# Altium schematic sheet imu.SchDoc
size A
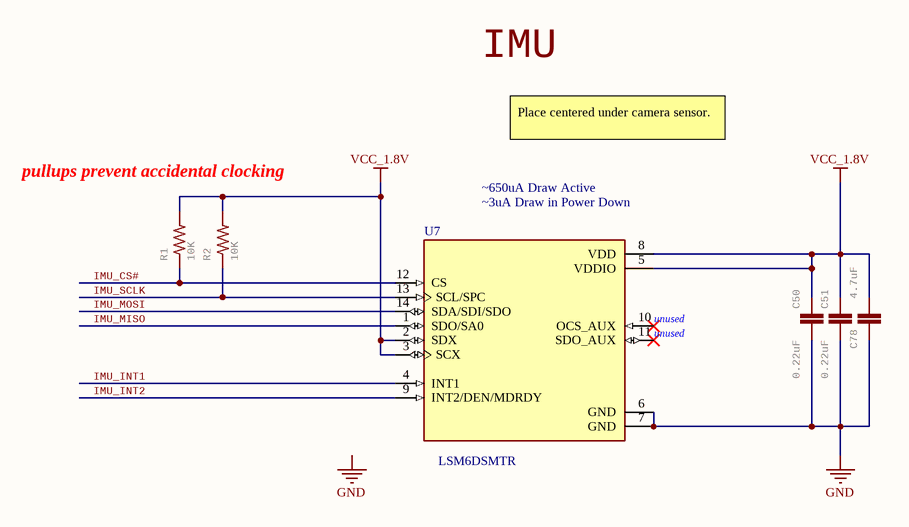
[diagram p0: imu.SchDoc]

## Parts
C50  0.22uF  [C0201]
C51  0.22uF  [C0201]
C78  4.7uF  [0402-CAP]
R1  10K  [R0201]
R2  10K  [R0201]
U7  (no value)  [LSM6DSMTR]

## Nets
GND: C50.2 C51.2 C78.1 U7.6(GND) U7.7(GND)
VCC_1.8V: C50.1 C51.1 C78.2 R1.2 R2.2 U7.2(SDX) U7.3(SCX) U7.5(VDDIO) U7.8(VDD)
IMU_CS#: R1.1 U7.12(CS)
IMU_INT1: U7.4(INT1)
IMU_INT2: U7.9(INT2/DEN/MDRDY)
IMU_MISO: U7.1(SDO/SA0)
IMU_MOSI: U7.14(SDA/SDI/SDO)
IMU_SCLK: R2.1 U7.13(SCL/SPC)

Not connected (* = marked no-connect by the designer): U7 10(OCS_AUX)* 11(SDO_AUX)*

## Notes on the sheet
- IMU
- pullups prevent accidental clocking
- ~650uA Draw Active
- Place centered under camera sensor.
- (near U7) ~3uA Draw in Power Down
- (near U7) unused
- Labels drawn without touching a wire or pin: GND

## Library data of the parts
C50 C51 = C-EUC0201: CAPACITOR, European symbol; MPN: GRM033R60J224ME15D; GateName_1: G$1; SymbolName_1: C-EU; POPULARITY: 0; DeviceName: C0201; LibraryName: rcl; DeviceSetName: C-EU; SPICEPREFIX: C; Part Number: GRM033R60J224ME15D
C78 = CAP_0402: 0402 (1005 Metric) Nick Garner - TeleSense; MPN: JMK105BBJ475MV-F; GateName_1: G$1; SymbolName_1: CAP; LibraryName: 0402; DeviceSetName: CAP_0402
R1 R2 = RESISTOR0402-RES: GateName_1: G$1; SymbolName_1: RESISTOR; LibraryName: sfe; DeviceSetName: RESISTOR
U7 = LSM6DSMTR: Accelerometer, Gyroscope, Temperature, 6 Axis Sensor IÂ²C, SPI Output; MF: STMicroelectronics; Design Item ID: LSM6DSMTR; Package: VFLGA-14 STMicroelectronics; Component Type: Standard; Price: None; Value: *; Pin Count: 14; SnapEDA_Link: https://www.snapeda.com/parts/LSM6DSMTR/STMicroelectronics/view-part/581716/?ref=snap; Availability: Unavailable; Source: SnapEDAsch.SchLib; MP: LSM6DSMTR; MPN: LSM6DSMTR; Part Number: LSM6DSMTR